# Altium schematic sheet MCU.SchDoc
size A; SheetNumber: 7; SheetTotal: 12
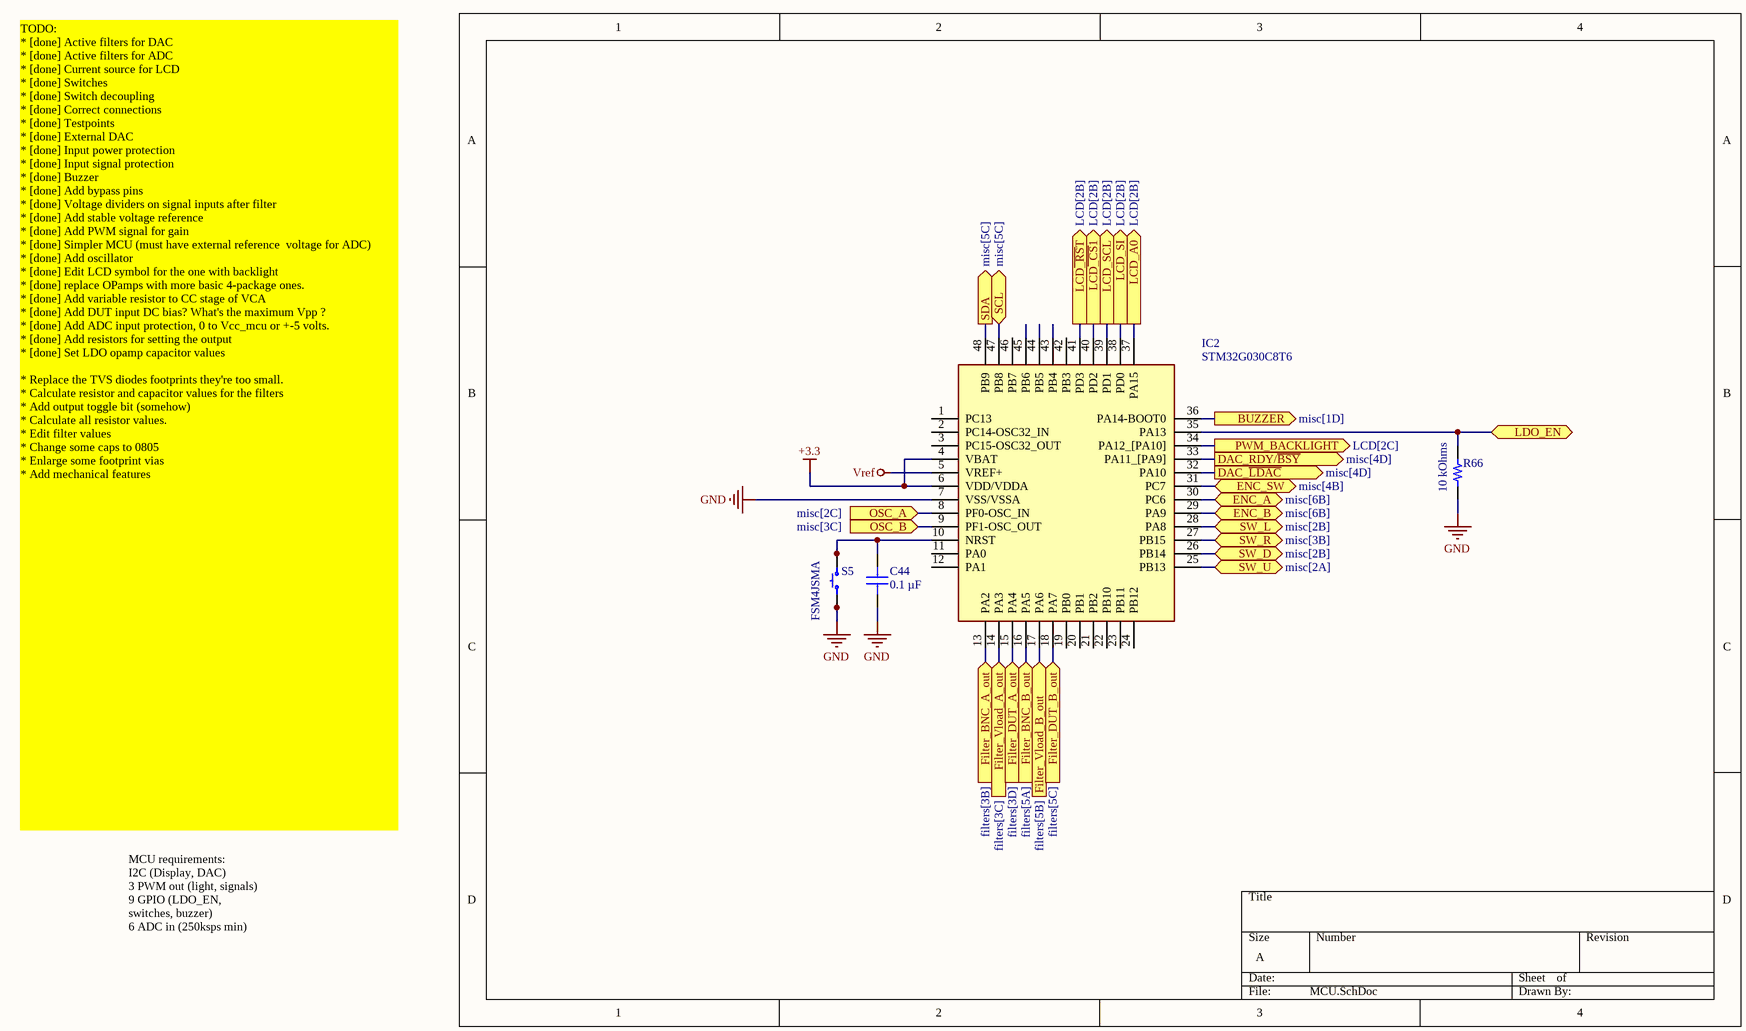
[diagram p0: MCU.SchDoc]

## Parts
C44  0.1 µF  [CAP 1206_3216 - 0.8MM]
IC2  STM32G030C8T6  [QFP50P900X900X160-48N]
R66  10 kOhms  [YAGEO RES 1206_3216]
S5  FSM4JSMA  [TE FSM4JSMA]

## Ports
BUZZER (out, see misc[1D]), DAC_RDY/~{BSY} (out, see misc[4D]), DAC_~{LDAC} (out, see misc[4D]), ENC_A (bidir, see misc[6B]), ENC_B (bidir, see misc[6B]), ENC_SW (bidir, see misc[4B]), Filter_BNC_A_out (in, see filters[3B]), Filter_BNC_B_out (in, see filters[5A]), Filter_DUT_A_out (in, see filters[3D]), Filter_DUT_B_out (in, see filters[5C]), Filter_Vload_A_out (in, see filters[3C]), Filter_Vload_B_out (in, see filters[5B]), LCD_A0 (out, see LCD[2B]), LCD_SCL (out, see LCD[2B]), LCD_SI (out, see LCD[2B]), LCD~{_CS}1 (out, see LCD[2B]), LCD~{_RS}T (out, see LCD[2B]), LDO_EN (bidir, see LDO[1B], power[3D]), OSC_A (in, see misc[2C]), OSC_B (in, see misc[3C]), PWM_BACKLIGHT (out, see LCD[2C]), SCL (bidir, see misc[5C]), SDA (out, see misc[5C]), SW_D (bidir, see misc[2B]), SW_L (bidir, see misc[2B]), SW_R (bidir, see misc[3B]), SW_U (bidir, see misc[2A])

## Nets
+3.3: IC2.4(VBAT) IC2.6(VDD/VDDA)
GND: C44.1 IC2.7(VSS/VSSA) R66.2 S5.1 S5.2
Vref: IC2.5(VREF+)
BUZZER: IC2.36(PA14-BOOT0) ; port BUZZER
DAC_~{LDAC}: IC2.32(PA10) ; port DAC_~{LDAC}
DAC_RDY/~{BSY}: IC2.33(PA11_[PA9]) ; port DAC_RDY/~{BSY}
ENC_A: IC2.30(PC6) ; port ENC_A
ENC_B: IC2.29(PA9) ; port ENC_B
ENC_SW: IC2.31(PC7) ; port ENC_SW
Filter_BNC_A_out: IC2.13(PA2) ; port Filter_BNC_A_out
Filter_BNC_B_out: IC2.16(PA5) ; port Filter_BNC_B_out
Filter_DUT_A_out: IC2.15(PA4) ; port Filter_DUT_A_out
Filter_DUT_B_out: IC2.18(PA7) ; port Filter_DUT_B_out
Filter_Vload_A_out: IC2.14(PA3) ; port Filter_Vload_A_out
Filter_Vload_B_out: IC2.17(PA6) ; port Filter_Vload_B_out
LCD~{_CS}1: IC2.40(PD2) ; port LCD~{_CS}1
LCD~{_RS}T: IC2.41(PD3) ; port LCD~{_RS}T
LCD_A0: IC2.37(PA15) ; port LCD_A0
LCD_SCL: IC2.39(PD1) ; port LCD_SCL
LCD_SI: IC2.38(PD0) ; port LCD_SI
LDO_EN: IC2.35(PA13) R66.1 ; port LDO_EN
OSC_A: IC2.8(PF0-OSC_IN) ; port OSC_A
OSC_B: IC2.9(PF1-OSC_OUT) ; port OSC_B
PWM_BACKLIGHT: IC2.34(PA12_[PA10]) ; port PWM_BACKLIGHT
SCL: IC2.47(PB8) ; port SCL
SDA: IC2.48(PB9) ; port SDA
SW_D: IC2.26(PB14) ; port SW_D
SW_L: IC2.28(PA8) ; port SW_L
SW_R: IC2.27(PB15) ; port SW_R
SW_U: IC2.25(PB13) ; port SW_U
NetC44_2: C44.2 IC2.10(NRST) S5.3 S5.4

Not connected (* = marked no-connect by the designer): IC2 1(PC13) 2(PC14-OSC32_IN) 3(PC15-OSC32_OUT) 11(PA0) 12(PA1) 19(PB0) 20(PB1) 21(PB2) 22(PB10) 23(PB11) 24(PB12) 42(PB3) 43(PB4) 44(PB5) 45(PB6) 46(PB7)

## Notes on the sheet
- TODO:
  * [done] Active filters for DAC
  * [done] Active filters for ADC
  * [done] Current source for LCD
  * [done] Switches
  * [done] Switch decoupling
  * [done] Correct connections
  * [done] Testpoints
  * [done] External DAC
  * [done] Input power protection
  * [done] Input signal protection
  * [done] Buzzer
  * [done] Add bypass pins
  * [done] Voltage dividers on signal inputs after filter
  * [done] Add stable voltage reference
  * [done] Add PWM signal for gain
  * [done] Simpler MCU (must have external reference  voltage for ADC)
  * [done] Add oscillator
  * [done] Edit LCD symbol for the one with backlight
  * [done] replace OPamps with more basic 4-package ones.
  * [done] Add variable resistor to CC stage of VCA
  * [done] Add DUT input DC bias? What's the maximum Vpp ?
  * [done] Add ADC input protection, 0 to Vcc_mcu or +-5 volts.
  * [done] Add resistors for setting the output
  * [done] Set LDO opamp capacitor values
  * Replace the TVS diodes footprints they're too small.
  * Calculate resistor and capacitor values for the filters
  * Add output toggle bit (somehow)
  * Calculate all resistor values.
  * Edit filter values
  * Change some caps to 0805
  * Enlarge some footprint vias
  * Add mechanical features
- MCU requirements:
  I2C (Display, DAC)
  3 PWM out (light, signals)
  9 GPIO (LDO_EN, switches, buzzer)
  6 ADC in (250ksps min)

## Library data of the parts
C44 = 885012208087: CAP CER 0.1UF 50V X7R 1206; manufacturer: Würth Elektronik; Tolerance: ±10%; Part Number: 885012208087; Capacitance: 0.1 µF; Applications: General Purpose; componentlink1description: Datasheet; componentlink1url: https://katalog.we-online.de/pbs/datasheet/885012208087.pdf; componentlink2description: DigiKey Link; componentlink2url: https://www.digikey.com/en/products/detail/würth-elektronik/885012208087/5453982; Device Package: 1206 (3216 Metric); lastupdated: 6/4/2024 19:10:27; Lifecycle Status: Active; Minimum Order: 1; Mounting Type: Surface Mount, MLCC; Operating Temperature: -55°C ~ 125°C; Package / Case: 1206 (3216 Metric); packaging: TapeAndReel; partid: 20879; Part Status: Active; price: 0.06; series: WCAP-CSGP; Size / Dimension: 0.126" L x 0.063" W (3.20mm x 1.60mm); Supplier 1: DigiKey; Supplier Part Number 1: 732-8127-1-ND; Temperature Coefficient: X7R; Thickness (Max): 0.035" (0.90mm); value: 0.1 µF; Voltage - Rated: 50V
IC2 = STM32G030C8T6: Integrated Circuit; Manufacturer_Name: STMicroelectronics; Datasheet Link: https://componentsearchengine.com/Datasheets/1/STM32G030C8T6.pdf; Height: 1.6mm; Manufacturer_Part_Number: STM32G030C8T6; Mouser Part Number: 511-STM32G030C8T6; Mouser Price/Stock: https://www.mouser.co.uk/ProductDetail/STMicroelectronics/STM32G030C8T6?qs=uwxL4vQweFMKBA8wRRkiWA%3D%3D; Arrow Part Number: STM32G030C8T6; Arrow Price/Stock: https://www.arrow.com/en/products/stm32g030c8t6/stmicroelectronics?utm_currency=USD&region=nac
R66 = RT1206FRE0710KL: RES SMD 10K OHM 1% 1/4W 1206; Manufacturer: Yageo; Power (Watts): 0.25W, 1/4W; Temperature Coefficient: ±50ppm/°C; Part Number: RT1206FRE0710KL; ComponentLink1Description: Datasheet; ComponentLink1URL: https://www.yageo.com/upload/media/product/productsearch/datasheet/rchip/PYu-RT_1-to-0.01_RoHS_L_11.pdf; ComponentLink2Description: DigiKey Link; ComponentLink2URL: https://www.digikey.com/en/products/detail/yageo/RT1206FRE0710KL/1082868; Composition: Thin Film; Device Package: 1206 (3216 Metric); Height - Seated (Max): 0.026" (0.65mm); LastUpdated: 7/25/2024 09:21:28; Lifecycle Status: Active; Minimum Order: 1; Number of Terminations: 2; Operating Temperature: -55°C ~ 155°C; Package / Case: 1206 (3216 Metric); Packaging: TapeAndReel; PartId: 38903; Part Status: Active; Price: 0.01; Resistance: 10 kOhms; Series: RT; Size / Dimension: 0.122" L x 0.063" W (3.10mm x 1.60mm); Supplier 1: DigiKey; Supplier Part Number 1: YAG1242CT-ND; Supplier Device Package: 1206; Tolerance: ±1%; Value: 10 kOhms
S5 = FSM4JSMA: SWITCH TACTILE SPST-NO 0.05A 24V; Manufacturer: TE Connectivity ALCOSWITCH Switches; Actuator Height off PCB, Vertical: 5.00mm; Actuator Orientation: Top Actuated; Actuator Type: Standard; Contact Rating @ Voltage: 0.05A @ 24VDC; Illumination: Non-Illuminated; Operating Force: 160gf; Outline: 6.00mm x 6.00mm; Switch Function: Off-Mom; Part Number: FSM4JSMA; Circuit: SPST-NO; ComponentLink1Description: Datasheet; ComponentLink1URL: https://www.te.com/commerce/DocumentDelivery/DDEController?Action=srchrtrv&DocNm=1308111-1_SWITCHES_CORE_PROGRAM_CATALOG&DocType=CS&DocLang=English; ComponentLink2Description: DigiKey Link; ComponentLink2URL: https://www.digikey.com/en/products/detail/te-connectivity-alcoswitch-switches/FSM4JSMA/525821; LastUpdated: 6/3/2024 20:19:31; Lifecycle Status: Active; Minimum Order: 1; Mounting Type: Surface Mount; Operating Temperature: -35°C ~ 85°C; Packaging: Bulk; Part Status: Active; Price: 0.14; Series: FSMJSMA; Supplier 1: DigiKey; Supplier Part Number 1: 450-1129-ND; Termination Style: Gull Wing